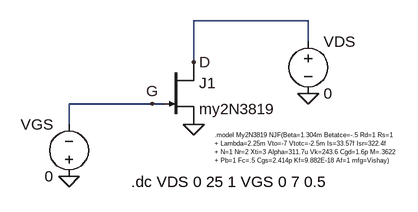
[diagram p0: schematic 001 JFET.asc]
001 JFET.asc, the LTspice schematic file:
Version 4
SHEET 1 2736 680
WIRE 352 -32 176 -32
WIRE 352 0 352 -32
WIRE 176 32 176 -32
WIRE 112 96 -16 96
WIRE 128 96 112 96
WIRE -16 128 -16 96
FLAG -16 208 0
FLAG 352 80 0
FLAG 176 32 D
FLAG 112 96 G
FLAG 176 128 0
SYMBOL voltage -16 224 R180
WINDOW 0 24 96 Left 2
WINDOW 3 24 16 Left 2
SYMATTR InstName VGS
SYMATTR Value 0
SYMBOL voltage 352 -16 R0
SYMATTR InstName VDS
SYMATTR Value 0
SYMBOL njf 128 32 R0
SYMATTR InstName J1
SYMATTR Value my2N3819
TEXT 80 216 Left 2 !.dc VDS 0 25 1 VGS 0 7 0.5
TEXT 208 144 Left 0 !.model My2N3819 NJF(Beta=1.304m Betatce=-.5 Rd=1 Rs=1 \n+ Lambda=2.25m Vto=-7 Vtotc=-2.5m Is=33.57f Isr=322.4f \n+ N=1 Nr=2 Xti=3 Alpha=311.7u Vk=243.6 Cgd=1.6p M=.3622 \n+ Pb=1 Fc=.5 Cgs=2.414p Kf=9.882E-18 Af=1 mfg=Vishay)

The netlist it stands for:
* 001 JFET.asc
VGS 0 G 0
VDS D 0 0
J1 D G 0 my2N3819
.model NJF NJF
.model PJF PJF
.lib standard.jft
.dc VDS 0 25 1 VGS 0 7 0.5
.model My2N3819 NJF(Beta=1.304m Betatce=-.5 Rd=1 Rs=1
+ Lambda=2.25m Vto=-7 Vtotc=-2.5m Is=33.57f Isr=322.4f
+ N=1 Nr=2 Xti=3 Alpha=311.7u Vk=243.6 Cgd=1.6p M=.3622
+ Pb=1 Fc=.5 Cgs=2.414p Kf=9.882E-18 Af=1 mfg=Vishay)
.backanno
.end